# Altium schematic sheet RFLNA-14dB.SchDoc: 14dB LNA
size Legal; CheckedBy: J. Brinton; CompanyName: Signal Laboratories, Inc.; DrawnBy: J. Brinton; Engineer: J. Brinton; Address1: 3479 Edison Way; Address2: Menlo Park CA 94025; Address3: +1 (877) 778-8435; Address4: siglabs.com; DocumentNumber: 53; Revision: 2b; SheetNumber: 54; SheetTotal: 58
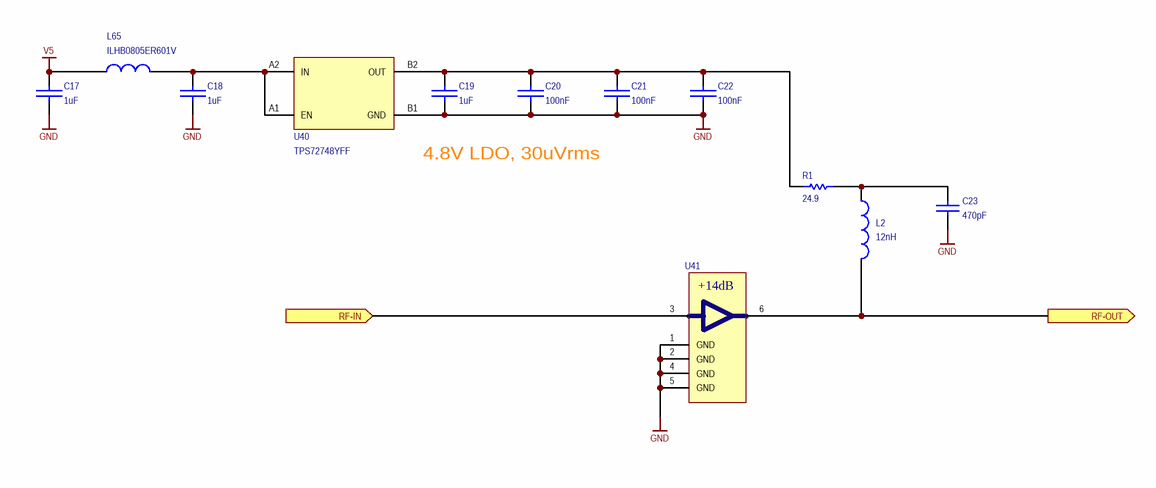
[diagram p0: RFLNA-14dB.SchDoc]

## Parts
C17  value 1uF  [0402]  (hidden comment: GRM155R61A105KE15D)
C18  value 1uF  [0402]  (hidden comment: GRM155R61A105KE15D)
C19  value 1uF  [0402]  (hidden comment: GRM155R61A105KE15D)
C20  value 100nF  [0402]  (hidden comment: GRM155R71C104KA88J)
C21  value 100nF  [0402]  (hidden comment: GRM155R71C104KA88J)
C22  value 100nF  [0402]  (hidden comment: GRM155R71C104KA88J)
C23  value 470pF  [0402]  (hidden comment: GRM1555C1H471JA01D)
L2  value 12nH  [0402]  (hidden comment: LQW15AN12NJ00D)
L65  ILHB0805ER601V  [0805]
R1  value 24.9  [0603]  (hidden comment: ERJ-3EKF24R9V)
U40  TPS72748YFF  [DSBGA-4]
U41  MAAL-009120  [SC70]  (value not drawn)

## Ports
RF-IN (in), RF-OUT (out)

## Nets
GND: C17.1 C18.1 C19.1 C20.1 C21.1 C22.1 C23.1 U40.B1(GND) U41.1(GND) U41.2(GND) U41.4(GND) U41.5(GND)
V5: C17.2 L65.2
RF-IN: U41.3(RF-IN) ; port RF-IN
RF-OUT: L2.2 U41.6(RF-OUT) ; port RF-OUT
NetC18_2: C18.2 L65.1 U40.A1(EN) U40.A2(IN)
NetC19_2: C19.2 C20.2 C21.2 C22.2 R1.1 U40.B2(OUT)
NetC23_2: C23.2 L2.1 R1.2

## Notes on the sheet
- 4.8V LDO, 30uVrms
- Title
- Engineer
- Revision
- Drawn By
- Checked By
- Date
- Sheet
- of
- (in symbol MAAL-009120) +14dB

## Library data of the parts
C17-C19 = CAP: Ceramic Capacitor 1uF ±10% 10V X5R 0402; Manufacturer: Murata; Tr: -55:125; Manufacturer P/N: GRM155R61A105KE15D; Package: 0402; Tolerance: ±10%; Voltage: 10V
C20-C22 = CAP: Ceramic Capacitor 100nF ±10% 16V X7R 0402; Manufacturer: Murata; Tr: -55:125; Manufacturer P/N: GRM155R71C104KA88J; Voltage: 16V; Package: 0402; Tolerance: ±10%
C23 = CAP 0402: Ceramic Capacitor 470pF ±5% 50V NP0 0402; Manufacturer: Murata; Tr: -55:125; Voltage: 50V; Manufacturer P/N: GRM1555C1H471JA01D; Package: 0402; Do Not Place: *; Tolerance: ±5%
L2 = INDUCTOR: Inductor Wirewound 12nH ±5% 0402; Manufacturer: Murata; Tr: -55:125; Manufacturer P/N: LQW15AN12NJ00D; Package: 0402; Tolerance: ±5%
L65 = INDUCTANCE1: Ferrite Bead 600-Ohm @ 100MHz 2A 0805; Manufacturer: Vishay Dale; Value: 600@100MHz; Tolerance: ±25%; Tr: -55:125; Manufacturer P/N: ILHB0805ER601V; Package: 0805
R1 = RES 0603: Thick Film Resistor 24.9 ±1% 0603; Manufacturer: Panasonic; Tr: -55:155; Package: 0603; Manufacturer P/N: ERJ-3EKF24R9V; Do Not Place: *; Tolerance: ±1%
U40 = TPS72748YFF: Ultralow Noise 30uVrms LDO, Fixed, 4.8V, 200mA; Manufacturer: Texas Instruments; Manufacturer P/N: TPS72748YFF
U41 = MAAL-009120: Broadband 14dB 70-3000MHz Gain Stage; Manufacturer: Macom; Manufacturer P/N: MAAL-009120